# Vivado block design design_1, xczu28dr-ffvg1517-2-e, Vivado 2021.1
# (continued, part 5 of 9)
current_bd_instance /mapping_ADC_to_chan

# ---- hierarchy /mapping_chan_to_DAC ----
current_bd_instance /mapping_chan_to_DAC
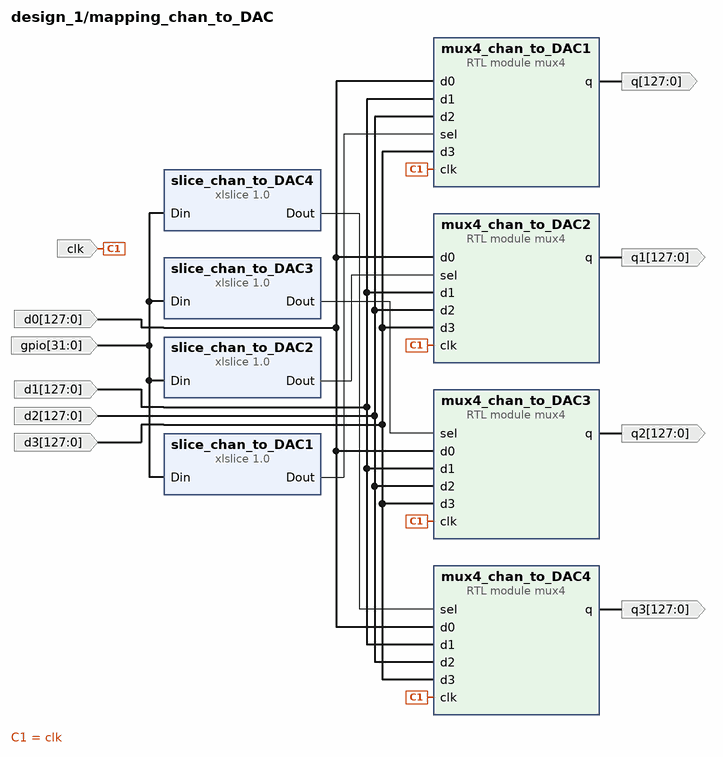
[diagram p43: block diagram inside /mapping_chan_to_DAC]
create_bd_pin -dir I -from 127 -to 0 d0
create_bd_pin -dir I -from 127 -to 0 d1
create_bd_pin -dir I -from 127 -to 0 d2
create_bd_pin -dir I -from 127 -to 0 d3
create_bd_pin -dir I -type clk clk
create_bd_pin -dir O -from 127 -to 0 q
create_bd_pin -dir I -from 31 -to 0 gpio
create_bd_pin -dir O -from 127 -to 0 q1
create_bd_pin -dir O -from 127 -to 0 q2
create_bd_pin -dir O -from 127 -to 0 q3

create_bd_cell -type ip -vlnv xilinx.com:ip:xlslice:1.0 slice_chan_to_DAC1
set_property -dict {CONFIG.DIN_FROM 1 CONFIG.DIN_TO 0 CONFIG.DOUT_WIDTH 2} [get_bd_cells slice_chan_to_DAC1]
create_bd_cell -type ip -vlnv xilinx.com:ip:xlslice:1.0 slice_chan_to_DAC2
set_property -dict {CONFIG.DIN_FROM 3 CONFIG.DIN_TO 2 CONFIG.DOUT_WIDTH 2} [get_bd_cells slice_chan_to_DAC2]
create_bd_cell -type ip -vlnv xilinx.com:ip:xlslice:1.0 slice_chan_to_DAC3
set_property -dict {CONFIG.DIN_FROM 5 CONFIG.DIN_TO 4 CONFIG.DOUT_WIDTH 2} [get_bd_cells slice_chan_to_DAC3]
create_bd_cell -type ip -vlnv xilinx.com:ip:xlslice:1.0 slice_chan_to_DAC4
set_property -dict {CONFIG.DIN_FROM 7 CONFIG.DIN_TO 6 CONFIG.DOUT_WIDTH 2} [get_bd_cells slice_chan_to_DAC4]
create_bd_cell -type module -reference mux4 mux4_chan_to_DAC2
set_property -dict {CONFIG.width 128} [get_bd_cells mux4_chan_to_DAC2]
create_bd_cell -type module -reference mux4 mux4_chan_to_DAC3
set_property -dict {CONFIG.width 128} [get_bd_cells mux4_chan_to_DAC3]
create_bd_cell -type module -reference mux4 mux4_chan_to_DAC4
set_property -dict {CONFIG.width 128} [get_bd_cells mux4_chan_to_DAC4]
create_bd_cell -type module -reference mux4 mux4_chan_to_DAC1
set_property -dict {CONFIG.width 128} [get_bd_cells mux4_chan_to_DAC1]

# ---- connections ----

current_bd_instance /ethWrapPort0
connect_bd_intf_net [get_bd_intf_pins S00_AXI] [get_bd_intf_pins eth_regs_0/S00_AXI]
connect_bd_net [get_bd_pins clk_125] \
  [get_bd_pins blk_mem_gen_0/clkb] [get_bd_pins c_shift_ram_0/CLK] [get_bd_pins c_accum_0/CLK] \
  [get_bd_pins eth_buffer_0/clk_eth]
connect_bd_net [get_bd_pins blk_mem_gen_0/doutb] [get_bd_pins eth_buffer_0/r_data]
connect_bd_net [get_bd_pins c_accum_0/Q] [get_bd_pins Q_packet_count]
connect_bd_net [get_bd_pins c_shift_ram_0/Q] [get_bd_pins Q_data_byte]
connect_bd_net -net chan1_accum_snap_sync [get_bd_pins start] [get_bd_pins eth_buffer_0/start]
connect_bd_net -net clk_wiz_0_clk_out1 [get_bd_pins clk_256] [get_bd_pins blk_mem_gen_0/clka] [get_bd_pins eth_buffer_0/clk_fab]
connect_bd_net [get_bd_pins dina] [get_bd_pins blk_mem_gen_0/dina]
connect_bd_net [get_bd_pins eth_buffer_0/data_byte] [get_bd_pins c_shift_ram_0/D]
connect_bd_net [get_bd_pins eth_buffer_0/eth_start_trig] [get_bd_pins c_accum_0/B] [get_bd_pins eth_start_trig]
connect_bd_net [get_bd_pins eth_buffer_0/r_data_addr] [get_bd_pins blk_mem_gen_0/addrb]
connect_bd_net [get_bd_pins eth_buffer_0/r_data_en] [get_bd_pins blk_mem_gen_0/enb]
connect_bd_net [get_bd_pins eth_buffer_0/w_data_addr] [get_bd_pins blk_mem_gen_0/addra]
connect_bd_net [get_bd_pins eth_buffer_0/w_data_en] [get_bd_pins blk_mem_gen_0/ena] [get_bd_pins blk_mem_gen_0/wea]
connect_bd_net [get_bd_pins eth_regs_0/dst_ip] [get_bd_pins dst_ip]
connect_bd_net [get_bd_pins eth_regs_0/dst_mac] [get_bd_pins dst_mac]
connect_bd_net [get_bd_pins eth_regs_0/src_ip] [get_bd_pins src_ip]
connect_bd_net [get_bd_pins eth_regs_0/src_mac] [get_bd_pins src_mac]
connect_bd_net [get_bd_pins r_max_count/dout] [get_bd_pins eth_buffer_0/r_max_count]
connect_bd_net -net rst_ps8_0_99M1_peripheral_aresetn [get_bd_pins s_axi_aresetn99] [get_bd_pins eth_regs_0/s00_axi_aresetn]
connect_bd_net -net s00_axi_aclk_1 [get_bd_pins s_axi_aclk99] [get_bd_pins eth_regs_0/s00_axi_aclk]
connect_bd_net -net xlconstant_1_dout [get_bd_pins w_max_count/dout] [get_bd_pins eth_buffer_0/w_max_count]

current_bd_instance /chan1
connect_bd_intf_net [get_bd_intf_pins S_AXI_bram_ctrl_0] [get_bd_intf_pins snap_data_capture/S_AXI_bram_ctrl_0]
connect_bd_intf_net [get_bd_intf_pins S_AXI_bram_ctrl_1] [get_bd_intf_pins snap_data_capture/S_AXI_bram_ctrl_1]
connect_bd_intf_net [get_bd_intf_pins S_AXI_gpio_0] [get_bd_intf_pins GPIO/S_AXI_gpio_0]
connect_bd_intf_net [get_bd_intf_pins S_AXI_gpio_1] [get_bd_intf_pins GPIO/S_AXI_gpio_1]
connect_bd_intf_net [get_bd_intf_pins S_AXI_gpio_2] [get_bd_intf_pins GPIO/S_AXI_gpio_2]
connect_bd_intf_net [get_bd_intf_pins S_AXI_gpio_3] [get_bd_intf_pins GPIO/S_AXI_gpio_3]
connect_bd_intf_net [get_bd_intf_pins S_AXI_gpio_4] [get_bd_intf_pins GPIO/S_AXI_gpio_4]
connect_bd_intf_net [get_bd_intf_pins S_AXI_gpio_5] [get_bd_intf_pins GPIO/S_AXI_gpio_5]
connect_bd_intf_net [get_bd_intf_pins S_AXI_gpio_6] [get_bd_intf_pins GPIO/S_AXI_gpio_6]
connect_bd_intf_net [get_bd_intf_pins S_AXI_gpio_7] [get_bd_intf_pins GPIO/S_AXI_gpio_7]
connect_bd_intf_net [get_bd_intf_pins S_AXI_gpio_8] [get_bd_intf_pins GPIO/S_AXI_gpio_8]
connect_bd_intf_net [get_bd_intf_pins S_AXI_gpio_9] [get_bd_intf_pins GPIO/S_AXI_gpio_9]
connect_bd_intf_net [get_bd_intf_pins S_AXI_gpio_10] [get_bd_intf_pins GPIO/S_AXI_gpio_10]
connect_bd_net [get_bd_pins ADC_data_im] [get_bd_pins fine_nco/ADC_data_im] [get_bd_pins snap_data_capture/ADC_data_im]
connect_bd_net [get_bd_pins ADC_data_re] [get_bd_pins fine_nco/ADC_data_re] [get_bd_pins snap_data_capture/ADC_data_re]
connect_bd_net -net clk_wiz_0_clk_out1 [get_bd_pins CLK] \
  [get_bd_pins c_shift_ram_4/CLK] [get_bd_pins psb3_0_0/clk] [get_bd_pins psb_out_post/clk] [get_bd_pins fine_nco/clk_256M] \
  [get_bd_pins snap_data_capture/clk_256M] [get_bd_pins receive1_3_0/clk]
connect_bd_net [get_bd_pins const_zero31/dout] [get_bd_pins xlconcat_6/In3]
connect_bd_net -net cordic_mix_v2_ADC_out_im_0 [get_bd_pins fine_nco/out_im_0] [get_bd_pins receive1_3_0/in_re_0]
connect_bd_net -net cordic_mix_v2_ADC_out_im_1 [get_bd_pins fine_nco/out_im_1] [get_bd_pins receive1_3_0/in_re_1]
connect_bd_net -net cordic_mix_v2_ADC_out_im_2 [get_bd_pins fine_nco/out_im_2] [get_bd_pins receive1_3_0/in_re_2]
connect_bd_net -net cordic_mix_v2_ADC_out_im_3 [get_bd_pins fine_nco/out_im_3] [get_bd_pins receive1_3_0/in_re_3]
connect_bd_net -net cordic_mix_v2_ADC_out_re_0 [get_bd_pins fine_nco/out_re_0] [get_bd_pins receive1_3_0/in_im_0]
connect_bd_net -net cordic_mix_v2_ADC_out_re_1 [get_bd_pins fine_nco/out_re_1] [get_bd_pins receive1_3_0/in_im_1]
connect_bd_net -net cordic_mix_v2_ADC_out_re_2 [get_bd_pins fine_nco/out_re_2] [get_bd_pins receive1_3_0/in_im_2]
connect_bd_net -net cordic_mix_v2_ADC_out_re_3 [get_bd_pins fine_nco/out_re_3] [get_bd_pins receive1_3_0/in_im_3]
connect_bd_net -net proc_sys_reset_0_peripheral_aresetn [get_bd_pins s_axi_aresetn256] [get_bd_pins snap_data_capture/s_axi_aresetn256]
connect_bd_net -net psb2_0_0_gout_psb_tvalid [get_bd_pins c_shift_ram_4/Q] [get_bd_pins receive1_3_0/in_tvalid]
connect_bd_net [get_bd_pins psb3_0_0/gout_ov_add] [get_bd_pins xlconcat_6/In2]
connect_bd_net [get_bd_pins psb3_0_0/gout_ov_ifft] [get_bd_pins xlconcat_6/In1]
connect_bd_net [get_bd_pins psb3_0_0/gout_psb_tvalid] [get_bd_pins c_shift_ram_4/D]
connect_bd_net -net psb_im0_1 [get_bd_pins psb3_0_0/gout_psb_im_0] [get_bd_pins psb_out_post/psb_im0]
connect_bd_net -net psb_im1_1 [get_bd_pins psb3_0_0/gout_psb_im_1] [get_bd_pins psb_out_post/psb_im1]
connect_bd_net -net psb_im2_1 [get_bd_pins psb3_0_0/gout_psb_im_2] [get_bd_pins psb_out_post/psb_im2]
connect_bd_net -net psb_im3_1 [get_bd_pins psb3_0_0/gout_psb_im_3] [get_bd_pins psb_out_post/psb_im3]
connect_bd_net -net psb_re0_1 [get_bd_pins psb3_0_0/gout_psb_re_0] [get_bd_pins psb_out_post/psb_re0]
connect_bd_net -net psb_re1_1 [get_bd_pins psb3_0_0/gout_psb_re_1] [get_bd_pins psb_out_post/psb_re1]
connect_bd_net -net psb_re2_1 [get_bd_pins psb3_0_0/gout_psb_re_2] [get_bd_pins psb_out_post/psb_re2]
connect_bd_net -net psb_re3_1 [get_bd_pins psb3_0_0/gout_psb_re_3] [get_bd_pins psb_out_post/psb_re3]
connect_bd_net [get_bd_pins receive1_3_0/acc_tvalid] [get_bd_pins snap_data_capture/tvalid]
connect_bd_net [get_bd_pins receive1_3_0/acc_tvalid_eth] [get_bd_pins acc_tvalid_eth]
connect_bd_net [get_bd_pins receive1_3_0/snap_i0] [get_bd_pins xlconcat_1/In0]
connect_bd_net [get_bd_pins receive1_3_0/snap_i1] [get_bd_pins xlconcat_1/In2]
connect_bd_net [get_bd_pins receive1_3_0/snap_i2] [get_bd_pins xlconcat_1/In4]
connect_bd_net [get_bd_pins receive1_3_0/snap_i3] [get_bd_pins xlconcat_1/In6]
connect_bd_net [get_bd_pins receive1_3_0/snap_q0] [get_bd_pins xlconcat_1/In1]
connect_bd_net [get_bd_pins receive1_3_0/snap_q1] [get_bd_pins xlconcat_1/In3]
connect_bd_net [get_bd_pins receive1_3_0/snap_q2] [get_bd_pins xlconcat_1/In5]
connect_bd_net [get_bd_pins receive1_3_0/snap_q3] [get_bd_pins xlconcat_1/In7]
connect_bd_net -net reset_Dout [get_bd_pins GPIO/psb_rst] [get_bd_pins psb3_0_0/gin_tl_reset]
connect_bd_net -net rst_ps8_0_99M_peripheral_aresetn [get_bd_pins s_axi_aresetn99] [get_bd_pins GPIO/s_axi_aresetn]
connect_bd_net -net scale_const16_1 [get_bd_pins GPIO/psb_postScale] [get_bd_pins psb_out_post/scale_const16]
connect_bd_net -net scaler_16bits_1_ov [get_bd_pins psb_out_post/ov] [get_bd_pins xlconcat_6/In0]
connect_bd_net -net scaler_16bits_1_psb_dac_im0 [get_bd_pins psb_out_post/psb_dac_im0] [get_bd_pins fine_nco/DAC_im_0]
connect_bd_net -net scaler_16bits_1_psb_dac_im1 [get_bd_pins psb_out_post/psb_dac_im1] [get_bd_pins fine_nco/DAC_im_1]
connect_bd_net -net scaler_16bits_1_psb_dac_im2 [get_bd_pins psb_out_post/psb_dac_im2] [get_bd_pins fine_nco/DAC_im_2]
connect_bd_net -net scaler_16bits_1_psb_dac_im3 [get_bd_pins psb_out_post/psb_dac_im3] [get_bd_pins fine_nco/DAC_im_3]
connect_bd_net -net scaler_16bits_1_psb_dac_re0 [get_bd_pins psb_out_post/psb_dac_re0] [get_bd_pins fine_nco/DAC_re_0]
connect_bd_net -net scaler_16bits_1_psb_dac_re1 [get_bd_pins psb_out_post/psb_dac_re1] [get_bd_pins fine_nco/DAC_re_1]
connect_bd_net -net scaler_16bits_1_psb_dac_re2 [get_bd_pins psb_out_post/psb_dac_re2] [get_bd_pins fine_nco/DAC_re_2]
connect_bd_net -net scaler_16bits_1_psb_dac_re3 [get_bd_pins psb_out_post/psb_dac_re3] [get_bd_pins fine_nco/DAC_re_3]
connect_bd_net -net start_Dout [get_bd_pins GPIO/psb_start] [get_bd_pins psb3_0_0/gin_tl_start] [get_bd_pins start_chan1]
connect_bd_net -net we_even_1_Dout [get_bd_pins GPIO/psb_tone_we_even1] [get_bd_pins psb3_0_0/gin_we_even_1]
connect_bd_net -net we_even_2_Dout [get_bd_pins GPIO/psb_tone_we_even2] [get_bd_pins psb3_0_0/gin_we_even_2]
connect_bd_net -net we_even_3_Dout [get_bd_pins GPIO/psb_tone_we_even3] [get_bd_pins psb3_0_0/gin_we_even_3]
connect_bd_net -net we_even_4_Dout [get_bd_pins GPIO/psb_tone_we_even4] [get_bd_pins psb3_0_0/gin_we_even_4]
connect_bd_net -net we_odd_10_Dout [get_bd_pins GPIO/psb_toneSelect_w_D3] [get_bd_pins psb3_0_0/ts_3]
connect_bd_net -net we_odd_11_Dout [get_bd_pins GPIO/psb_toneSelect_w_D4] [get_bd_pins psb3_0_0/ts_4]
connect_bd_net -net we_odd_12_Dout [get_bd_pins GPIO/psb_toneSelect_w_D5] [get_bd_pins psb3_0_0/ts_5]
connect_bd_net -net we_odd_13_Dout [get_bd_pins GPIO/psb_toneSelect_w_D6] [get_bd_pins psb3_0_0/ts_6]
connect_bd_net -net we_odd_14_Dout [get_bd_pins GPIO/psb_toneSelect_w_D7] [get_bd_pins psb3_0_0/ts_7]
connect_bd_net -net we_odd_1_Dout [get_bd_pins GPIO/psb_tone_we_odd1] [get_bd_pins psb3_0_0/gin_we_odd_1]
connect_bd_net -net we_odd_2_Dout [get_bd_pins GPIO/psb_tone_we_odd2] [get_bd_pins psb3_0_0/gin_we_odd_2]
connect_bd_net -net we_odd_3_Dout [get_bd_pins GPIO/psb_tone_we_odd3] [get_bd_pins psb3_0_0/gin_we_odd_3]
connect_bd_net -net we_odd_4_Dout [get_bd_pins GPIO/psb_tone_we_odd4] [get_bd_pins psb3_0_0/gin_we_odd_4]
connect_bd_net -net we_odd_5_Dout [get_bd_pins GPIO/psb_toneSelect_we] [get_bd_pins psb3_0_0/ts_w]
connect_bd_net -net we_odd_6_Dout [get_bd_pins GPIO/psb_toneSelect_w_addr] [get_bd_pins psb3_0_0/ts_a]
connect_bd_net -net we_odd_7_Dout [get_bd_pins GPIO/psb_toneSelect_w_D0] [get_bd_pins psb3_0_0/ts_0]
connect_bd_net -net we_odd_8_Dout [get_bd_pins GPIO/psb_toneSelect_w_D1] [get_bd_pins psb3_0_0/ts_1]
connect_bd_net -net we_odd_9_Dout [get_bd_pins GPIO/psb_toneSelect_w_D2] [get_bd_pins psb3_0_0/ts_2]
connect_bd_net -net xlconcat_0_dout [get_bd_pins fine_nco/to_DAC] [get_bd_pins to_DAC] [get_bd_pins snap_data_capture/DAC_data]
connect_bd_net [get_bd_pins xlconcat_1/dout] [get_bd_pins timestream_out] [get_bd_pins snap_data_capture/rec_output]
connect_bd_net [get_bd_pins xlconcat_6/dout] [get_bd_pins GPIO/dsp_ov_flag]
connect_bd_net [get_bd_pins xlconstant_7/dout] [get_bd_pins fine_nco/sync_in]
connect_bd_net -net xlslice_0_Dout [get_bd_pins GPIO/psb_tone_w_init_re] [get_bd_pins psb3_0_0/gin_init_re]
connect_bd_net -net xlslice_1_Dout [get_bd_pins GPIO/psb_tone_w_init_im] [get_bd_pins psb3_0_0/gin_init_im]
connect_bd_net -net xlslice_3_Dout [get_bd_pins GPIO/psb_tone_w_addr] [get_bd_pins psb3_0_0/gin_addr]
connect_bd_net -net xlslice_4_Dout [get_bd_pins GPIO/psb_tone_w_dphi] [get_bd_pins psb3_0_0/gin_dphi]
connect_bd_net -net xlslice_5_Dout [get_bd_pins GPIO/rec_acc_length] [get_bd_pins receive1_3_0/acc_length]
connect_bd_net -net xlslice_beat_addr_Dout [get_bd_pins GPIO/rec_beatDphi_w_addr] [get_bd_pins receive1_3_0/w_beat_addr]
connect_bd_net -net xlslice_beat_dphi_Dout [get_bd_pins GPIO/rec_beatDphi_w_D] [get_bd_pins receive1_3_0/w_beat_dphi]
connect_bd_net -net xlslice_beat_we0_Dout [get_bd_pins GPIO/rec_beatDphi_we0] [get_bd_pins receive1_3_0/beat_we0]
connect_bd_net -net xlslice_beat_we1_Dout [get_bd_pins GPIO/rec_beatDphi_we1] [get_bd_pins receive1_3_0/beat_we1]
connect_bd_net -net xlslice_beat_we2_Dout [get_bd_pins GPIO/rec_beatDphi_we2] [get_bd_pins receive1_3_0/beat_we2]
connect_bd_net -net xlslice_beat_we3_Dout [get_bd_pins GPIO/rec_beatDphi_we3] [get_bd_pins receive1_3_0/beat_we3]
connect_bd_net -net xlslice_bin_sel_addr_Dout [get_bd_pins GPIO/rec_binSelect_w_addr] [get_bd_pins receive1_3_0/w_binsel_addr]
connect_bd_net -net xlslice_bin_sel_data1_Dout [get_bd_pins GPIO/rec_binSelect_w_D1] [get_bd_pins receive1_3_0/w_binsel_data1]
connect_bd_net -net xlslice_bin_sel_data_Dout [get_bd_pins GPIO/rec_binSelect_w_D0] [get_bd_pins receive1_3_0/w_binsel_data0]
connect_bd_net -net xlslice_bin_sel_we_Dout [get_bd_pins GPIO/rec_binSelect_we] [get_bd_pins receive1_3_0/binsel_we]
connect_bd_net -net xlslice_bram_rst_Dout [get_bd_pins GPIO/getAccumCtrl_rst] [get_bd_pins snap_data_capture/getAccumCtrl_rst]
connect_bd_net -net xlslice_bramx32v2_start_Dout [get_bd_pins GPIO/axibramx32v2_start] [get_bd_pins snap_data_capture/axibramx32v2_start]
connect_bd_net -net xlslice_dacmix_dp_Dout [get_bd_pins GPIO/fineNCO_dphi] [get_bd_pins fine_nco/dphi]
connect_bd_net -net xlslice_fft_scale_Dout [get_bd_pins GPIO/rec_fft_scale] [get_bd_pins receive1_3_0/fft_scale]
connect_bd_net -net xlslice_getAccumChan_Dout [get_bd_pins GPIO/getAccum_channel_count] [get_bd_pins snap_data_capture/max_chan_minus_three]
connect_bd_net -net zynq_ultra_ps_e_0_pl_clk0 [get_bd_pins s_axi_aclk99] [get_bd_pins GPIO/s_axi_aclk]

current_bd_instance /chan1/snap_data_capture
connect_bd_intf_net [get_bd_intf_pins axi_bram_ctrl_0/BRAM_PORTA] [get_bd_intf_pins blk_mem_gen_0/BRAM_PORTA]
connect_bd_intf_net [get_bd_intf_pins axi_bram_ctrl_1/BRAM_PORTA] [get_bd_intf_pins blk_mem_gen_1/BRAM_PORTA]
connect_bd_intf_net [get_bd_intf_pins S_AXI_bram_ctrl_0] [get_bd_intf_pins axi_bram_ctrl_0/S_AXI]
connect_bd_intf_net [get_bd_intf_pins S_AXI_bram_ctrl_1] [get_bd_intf_pins axi_bram_ctrl_1/S_AXI]
connect_bd_net [get_bd_pins ADC_data_im] [get_bd_pins c_shift_ram_3/D]
connect_bd_net [get_bd_pins ADC_data_re] [get_bd_pins c_shift_ram_2/D]
connect_bd_net -net axibramx32v1_0_we [get_bd_pins axibramx32v2_0/we] \
  [get_bd_pins xlconcat_3/In0] [get_bd_pins xlconcat_3/In1] [get_bd_pins xlconcat_3/In2] [get_bd_pins xlconcat_3/In3] \
  [get_bd_pins xlconcat_3/In4] [get_bd_pins xlconcat_3/In5] [get_bd_pins xlconcat_3/In6] [get_bd_pins xlconcat_3/In7] \
  [get_bd_pins xlconcat_3/In8] [get_bd_pins xlconcat_3/In9] [get_bd_pins xlconcat_3/In10] [get_bd_pins xlconcat_3/In11] \
  [get_bd_pins xlconcat_3/In13] [get_bd_pins xlconcat_3/In12] [get_bd_pins xlconcat_3/In14] [get_bd_pins xlconcat_3/In15] \
  [get_bd_pins xlconcat_3/In16] [get_bd_pins xlconcat_3/In17] [get_bd_pins xlconcat_3/In18] [get_bd_pins xlconcat_3/In19] \
  [get_bd_pins xlconcat_3/In20] [get_bd_pins xlconcat_3/In21] [get_bd_pins xlconcat_3/In22] [get_bd_pins xlconcat_3/In23] \
  [get_bd_pins xlconcat_3/In24] [get_bd_pins xlconcat_3/In25] [get_bd_pins xlconcat_3/In26] [get_bd_pins xlconcat_3/In27] \
  [get_bd_pins xlconcat_3/In28] [get_bd_pins xlconcat_3/In29] [get_bd_pins xlconcat_3/In30] [get_bd_pins xlconcat_3/In31]
connect_bd_net -net axibramx32v1_0_we1 [get_bd_pins getAccumCtrl_0/we] \
  [get_bd_pins xlconcat_4/In0] [get_bd_pins xlconcat_4/In1] [get_bd_pins xlconcat_4/In2] [get_bd_pins xlconcat_4/In3] \
  [get_bd_pins xlconcat_4/In4] [get_bd_pins xlconcat_4/In5] [get_bd_pins xlconcat_4/In6] [get_bd_pins xlconcat_4/In7] \
  [get_bd_pins xlconcat_4/In8] [get_bd_pins xlconcat_4/In9] [get_bd_pins xlconcat_4/In10] [get_bd_pins xlconcat_4/In11] \
  [get_bd_pins xlconcat_4/In12] [get_bd_pins xlconcat_4/In13] [get_bd_pins xlconcat_4/In14] [get_bd_pins xlconcat_4/In15] \
  [get_bd_pins xlconcat_4/In16] [get_bd_pins xlconcat_4/In17] [get_bd_pins xlconcat_4/In18] [get_bd_pins xlconcat_4/In19] \
  [get_bd_pins xlconcat_4/In20] [get_bd_pins xlconcat_4/In21] [get_bd_pins xlconcat_4/In22] [get_bd_pins xlconcat_4/In23] \
  [get_bd_pins xlconcat_4/In24] [get_bd_pins xlconcat_4/In25] [get_bd_pins xlconcat_4/In26] [get_bd_pins xlconcat_4/In27] \
  [get_bd_pins xlconcat_4/In28] [get_bd_pins xlconcat_4/In29] [get_bd_pins xlconcat_4/In30] [get_bd_pins xlconcat_4/In31]
connect_bd_net [get_bd_pins axibramx32v2_0/addr] [get_bd_pins blk_mem_gen_0/addrb]
connect_bd_net [get_bd_pins bool_one/dout] [get_bd_pins blk_mem_gen_0/enb] [get_bd_pins blk_mem_gen_1/enb]
connect_bd_net [get_bd_pins bool_zero/dout] [get_bd_pins blk_mem_gen_0/rstb] [get_bd_pins blk_mem_gen_1/rstb]
connect_bd_net [get_bd_pins c_shift_ram_0/Q] [get_bd_pins blk_mem_gen_1/dinb]
connect_bd_net [get_bd_pins c_shift_ram_1/Q] [get_bd_pins xlconcat_DataConv/In0]
connect_bd_net [get_bd_pins c_shift_ram_2/Q] [get_bd_pins xlconcat_DataConv/In1]
connect_bd_net [get_bd_pins c_shift_ram_3/Q] [get_bd_pins xlconcat_DataConv/In2]
connect_bd_net -net clk_wiz_0_clk_out1 [get_bd_pins clk_256M] \
  [get_bd_pins blk_mem_gen_0/clkb] [get_bd_pins axi_bram_ctrl_0/s_axi_aclk] [get_bd_pins blk_mem_gen_1/clkb] \
  [get_bd_pins axi_bram_ctrl_1/s_axi_aclk] [get_bd_pins getAccumCtrl_0/clk] [get_bd_pins axibramx32v2_0/clk] \
  [get_bd_pins c_shift_ram_0/CLK] [get_bd_pins c_shift_ram_3/CLK] [get_bd_pins c_shift_ram_1/CLK] \
  [get_bd_pins c_shift_ram_2/CLK]
connect_bd_net -net const_2097088_dout [get_bd_pins const_65472/dout] \
  [get_bd_pins axibramx32v2_0/max_count_minus_two_steps] [get_bd_pins getAccumCtrl_0/max_count_minus_two_step]
connect_bd_net [get_bd_pins getAccumCtrl_0/addr] [get_bd_pins blk_mem_gen_1/addrb]
connect_bd_net -net proc_sys_reset_0_peripheral_aresetn [get_bd_pins s_axi_aresetn256] \
  [get_bd_pins axi_bram_ctrl_1/s_axi_aresetn] [get_bd_pins axi_bram_ctrl_0/s_axi_aresetn]
connect_bd_net -net receive1_3_0_acc_tvalid [get_bd_pins tvalid] [get_bd_pins getAccumCtrl_0/tvalid]
connect_bd_net -net xlconcat_0_dout [get_bd_pins DAC_data] [get_bd_pins c_shift_ram_1/D]
connect_bd_net -net xlconcat_1_dout [get_bd_pins rec_output] [get_bd_pins c_shift_ram_0/D]
connect_bd_net [get_bd_pins xlconcat_3/dout] [get_bd_pins blk_mem_gen_0/web]
connect_bd_net [get_bd_pins xlconcat_4/dout] [get_bd_pins blk_mem_gen_1/web]
connect_bd_net -net xlconcat_ADCout_dout [get_bd_pins xlconcat_DataConv/dout] [get_bd_pins blk_mem_gen_0/dinb]
connect_bd_net -net xlslice_bram_rst_Dout [get_bd_pins getAccumCtrl_rst] [get_bd_pins getAccumCtrl_0/rst]
connect_bd_net -net xlslice_bramx32v2_start_Dout [get_bd_pins axibramx32v2_start] [get_bd_pins axibramx32v2_0/rising_edge_start]
connect_bd_net -net xlslice_getAccumChan_Dout [get_bd_pins max_chan_minus_three] [get_bd_pins getAccumCtrl_0/max_chan_minus_three]

current_bd_instance /chan1/GPIO
connect_bd_intf_net [get_bd_intf_pins S_AXI_gpio_5] [get_bd_intf_pins axi_gpio_5/S_AXI]
connect_bd_intf_net [get_bd_intf_pins S_AXI_gpio_0] [get_bd_intf_pins axi_gpio_0/S_AXI]
connect_bd_intf_net [get_bd_intf_pins S_AXI_gpio_1] [get_bd_intf_pins axi_gpio_1/S_AXI]
connect_bd_intf_net [get_bd_intf_pins S_AXI_gpio_2] [get_bd_intf_pins axi_gpio_2/S_AXI]
connect_bd_intf_net [get_bd_intf_pins S_AXI_gpio_3] [get_bd_intf_pins axi_gpio_3/S_AXI]
connect_bd_intf_net [get_bd_intf_pins S_AXI_gpio_4] [get_bd_intf_pins axi_gpio_4/S_AXI]
connect_bd_intf_net [get_bd_intf_pins S_AXI_gpio_6] [get_bd_intf_pins axi_gpio_6/S_AXI]
connect_bd_intf_net [get_bd_intf_pins S_AXI_gpio_7] [get_bd_intf_pins axi_gpio_7/S_AXI]
connect_bd_intf_net [get_bd_intf_pins S_AXI_gpio_8] [get_bd_intf_pins axi_gpio_8/S_AXI]
connect_bd_intf_net [get_bd_intf_pins S_AXI_gpio_9] [get_bd_intf_pins axi_gpio_9/S_AXI]
connect_bd_intf_net [get_bd_intf_pins S_AXI_gpio_10] [get_bd_intf_pins axi_gpio_10/S_AXI]
connect_bd_net [get_bd_pins axi_gpio_4/gpio_io_o] \
  [get_bd_pins xlslice_beat_we0/Din] [get_bd_pins xlslice_beat_we1/Din] [get_bd_pins xlslice_beat_we2/Din] \
  [get_bd_pins xlslice_beat_we3/Din] [get_bd_pins xlslice_beat_dphi/Din] [get_bd_pins xlslice_beat_addr/Din]
connect_bd_net [get_bd_pins axi_gpio_9/gpio_io_o] [get_bd_pins xlslice_bin_sel_addr/Din] [get_bd_pins xlslice_bin_sel_data0/Din]
connect_bd_net [get_bd_pins axi_gpio_0/gpio_io_o] [get_bd_pins start/Din] [get_bd_pins reset/Din]
connect_bd_net [get_bd_pins axi_gpio_10/gpio_io_o] [get_bd_pins xlslice_mix_dp/Din]
connect_bd_net [get_bd_pins axi_gpio_1/gpio2_io_o] [get_bd_pins xlslice_3/Din] [get_bd_pins xlslice_4/Din]
connect_bd_net [get_bd_pins axi_gpio_1/gpio_io_o] \
  [get_bd_pins we_even_1/Din] [get_bd_pins we_even_2/Din] [get_bd_pins we_even_3/Din] [get_bd_pins we_even_4/Din] \
  [get_bd_pins we_odd_1/Din] [get_bd_pins we_odd_2/Din] [get_bd_pins we_odd_3/Din] [get_bd_pins we_odd_4/Din]
connect_bd_net [get_bd_pins axi_gpio_2/gpio2_io_o] [get_bd_pins xlslice_1/Din]
connect_bd_net [get_bd_pins axi_gpio_2/gpio_io_o] [get_bd_pins xlslice_0/Din]
connect_bd_net [get_bd_pins axi_gpio_3/gpio2_io_o] [get_bd_pins xlslice_bramx32v2_start/Din] [get_bd_pins xlslice_getAccum_rst/Din]
connect_bd_net [get_bd_pins axi_gpio_3/gpio_io_o] [get_bd_pins xlslice_acc_length/Din] [get_bd_pins xlslice_getAccumChan/Din]
connect_bd_net [get_bd_pins axi_gpio_4/gpio2_io_o] [get_bd_pins xlslice_fft_scale/Din]
connect_bd_net [get_bd_pins axi_gpio_5/gpio_io_o] [get_bd_pins xlslice_PSBscaleC/Din]
connect_bd_net [get_bd_pins axi_gpio_6/gpio2_io_o] [get_bd_pins we_odd_6/Din]
connect_bd_net [get_bd_pins axi_gpio_6/gpio_io_o] [get_bd_pins we_odd_5/Din]
connect_bd_net [get_bd_pins axi_gpio_7/gpio2_io_o] [get_bd_pins we_odd_9/Din] [get_bd_pins we_odd_10/Din]
connect_bd_net [get_bd_pins axi_gpio_7/gpio_io_o] [get_bd_pins we_odd_7/Din] [get_bd_pins we_odd_8/Din]
connect_bd_net [get_bd_pins axi_gpio_8/gpio2_io_o] [get_bd_pins we_odd_13/Din] [get_bd_pins we_odd_14/Din]
connect_bd_net [get_bd_pins axi_gpio_8/gpio_io_o] [get_bd_pins we_odd_11/Din] [get_bd_pins we_odd_12/Din]
connect_bd_net [get_bd_pins axi_gpio_9/gpio2_io_o] [get_bd_pins xlslice_bin_sel_data1/Din] [get_bd_pins xlslice_bin_sel_we/Din]
connect_bd_net -net gpio2_io_i_1 [get_bd_pins dsp_ov_flag] [get_bd_pins axi_gpio_5/gpio2_io_i]
connect_bd_net [get_bd_pins reset/Dout] [get_bd_pins psb_rst]
connect_bd_net -net rst_ps8_0_99M_peripheral_aresetn [get_bd_pins s_axi_aresetn] \
  [get_bd_pins axi_gpio_0/s_axi_aresetn] [get_bd_pins axi_gpio_1/s_axi_aresetn] [get_bd_pins axi_gpio_2/s_axi_aresetn] \
  [get_bd_pins axi_gpio_3/s_axi_aresetn] [get_bd_pins axi_gpio_4/s_axi_aresetn] [get_bd_pins axi_gpio_7/s_axi_aresetn] \
  [get_bd_pins axi_gpio_8/s_axi_aresetn] [get_bd_pins axi_gpio_9/s_axi_aresetn] [get_bd_pins axi_gpio_10/s_axi_aresetn] \
  [get_bd_pins axi_gpio_6/s_axi_aresetn] [get_bd_pins axi_gpio_5/s_axi_aresetn]
connect_bd_net [get_bd_pins start/Dout] [get_bd_pins psb_start]
connect_bd_net [get_bd_pins we_even_1/Dout] [get_bd_pins psb_tone_we_even1]
connect_bd_net [get_bd_pins we_even_2/Dout] [get_bd_pins psb_tone_we_even2]
connect_bd_net [get_bd_pins we_even_3/Dout] [get_bd_pins psb_tone_we_even3]
connect_bd_net [get_bd_pins we_even_4/Dout] [get_bd_pins psb_tone_we_even4]
connect_bd_net [get_bd_pins we_odd_10/Dout] [get_bd_pins psb_toneSelect_w_D3]
connect_bd_net [get_bd_pins we_odd_11/Dout] [get_bd_pins psb_toneSelect_w_D4]
connect_bd_net [get_bd_pins we_odd_12/Dout] [get_bd_pins psb_toneSelect_w_D5]
connect_bd_net [get_bd_pins we_odd_13/Dout] [get_bd_pins psb_toneSelect_w_D6]
connect_bd_net [get_bd_pins we_odd_14/Dout] [get_bd_pins psb_toneSelect_w_D7]
connect_bd_net [get_bd_pins we_odd_1/Dout] [get_bd_pins psb_tone_we_odd1]
connect_bd_net [get_bd_pins we_odd_2/Dout] [get_bd_pins psb_tone_we_odd2]
connect_bd_net [get_bd_pins we_odd_3/Dout] [get_bd_pins psb_tone_we_odd3]
connect_bd_net [get_bd_pins we_odd_4/Dout] [get_bd_pins psb_tone_we_odd4]
connect_bd_net [get_bd_pins we_odd_5/Dout] [get_bd_pins psb_toneSelect_we]
connect_bd_net [get_bd_pins we_odd_6/Dout] [get_bd_pins psb_toneSelect_w_addr]
connect_bd_net [get_bd_pins we_odd_7/Dout] [get_bd_pins psb_toneSelect_w_D0]
connect_bd_net [get_bd_pins we_odd_8/Dout] [get_bd_pins psb_toneSelect_w_D1]
connect_bd_net [get_bd_pins we_odd_9/Dout] [get_bd_pins psb_toneSelect_w_D2]
connect_bd_net [get_bd_pins xlslice_0/Dout] [get_bd_pins psb_tone_w_init_re]
connect_bd_net [get_bd_pins xlslice_1/Dout] [get_bd_pins psb_tone_w_init_im]
connect_bd_net [get_bd_pins xlslice_3/Dout] [get_bd_pins psb_tone_w_addr]
connect_bd_net [get_bd_pins xlslice_4/Dout] [get_bd_pins psb_tone_w_dphi]
connect_bd_net -net xlslice_5_Dout [get_bd_pins xlslice_acc_length/Dout] [get_bd_pins rec_acc_length]
connect_bd_net [get_bd_pins xlslice_PSBscaleC/Dout] [get_bd_pins psb_postScale]
connect_bd_net [get_bd_pins xlslice_beat_addr/Dout] [get_bd_pins rec_beatDphi_w_addr]
connect_bd_net [get_bd_pins xlslice_beat_dphi/Dout] [get_bd_pins rec_beatDphi_w_D]
connect_bd_net [get_bd_pins xlslice_beat_we0/Dout] [get_bd_pins rec_beatDphi_we0]
connect_bd_net [get_bd_pins xlslice_beat_we1/Dout] [get_bd_pins rec_beatDphi_we1]
connect_bd_net [get_bd_pins xlslice_beat_we2/Dout] [get_bd_pins rec_beatDphi_we2]
connect_bd_net [get_bd_pins xlslice_beat_we3/Dout] [get_bd_pins rec_beatDphi_we3]
connect_bd_net [get_bd_pins xlslice_bin_sel_addr/Dout] [get_bd_pins rec_binSelect_w_addr]
connect_bd_net [get_bd_pins xlslice_bin_sel_data1/Dout] [get_bd_pins rec_binSelect_w_D1]
connect_bd_net -net xlslice_bin_sel_data_Dout [get_bd_pins xlslice_bin_sel_data0/Dout] [get_bd_pins rec_binSelect_w_D0]
connect_bd_net [get_bd_pins xlslice_bin_sel_we/Dout] [get_bd_pins rec_binSelect_we]
connect_bd_net -net xlslice_bram_rst_Dout [get_bd_pins xlslice_getAccum_rst/Dout] [get_bd_pins getAccumCtrl_rst]
connect_bd_net [get_bd_pins xlslice_bramx32v2_start/Dout] [get_bd_pins axibramx32v2_start]
connect_bd_net -net xlslice_dacmix_dp_Dout [get_bd_pins xlslice_mix_dp/Dout] [get_bd_pins fineNCO_dphi]
connect_bd_net [get_bd_pins xlslice_fft_scale/Dout] [get_bd_pins rec_fft_scale]
connect_bd_net [get_bd_pins xlslice_getAccumChan/Dout] [get_bd_pins getAccum_channel_count]
connect_bd_net -net zynq_ultra_ps_e_0_pl_clk0 [get_bd_pins s_axi_aclk] \
  [get_bd_pins axi_gpio_0/s_axi_aclk] [get_bd_pins axi_gpio_1/s_axi_aclk] [get_bd_pins axi_gpio_2/s_axi_aclk] \
  [get_bd_pins axi_gpio_3/s_axi_aclk] [get_bd_pins axi_gpio_4/s_axi_aclk] [get_bd_pins axi_gpio_7/s_axi_aclk] \
  [get_bd_pins axi_gpio_8/s_axi_aclk] [get_bd_pins axi_gpio_9/s_axi_aclk] [get_bd_pins axi_gpio_10/s_axi_aclk] \
  [get_bd_pins axi_gpio_6/s_axi_aclk] [get_bd_pins axi_gpio_5/s_axi_aclk]

current_bd_instance /chan1/psb_out_post
connect_bd_net [get_bd_pins psb_im0] [get_bd_pins xlslice_5/Din] [get_bd_pins xlslice_2/Din]
connect_bd_net [get_bd_pins psb_im1] [get_bd_pins xlslice_6/Din] [get_bd_pins xlslice_13/Din]
connect_bd_net [get_bd_pins psb_im2] [get_bd_pins xlslice_7/Din] [get_bd_pins xlslice_14/Din]
connect_bd_net [get_bd_pins psb_im3] [get_bd_pins xlslice_8/Din] [get_bd_pins xlslice_15/Din]
connect_bd_net [get_bd_pins psb_re0] [get_bd_pins xlslice_9/Din] [get_bd_pins xlslice_16/Din]
connect_bd_net [get_bd_pins psb_re1] [get_bd_pins xlslice_18/Din] [get_bd_pins xlslice_10/Din]
connect_bd_net [get_bd_pins psb_re2] [get_bd_pins xlslice_17/Din] [get_bd_pins xlslice_11/Din]
connect_bd_net [get_bd_pins psb_re3] [get_bd_pins xlslice_19/Din] [get_bd_pins xlslice_12/Din]
connect_bd_net -net clk_wiz_0_clk_out1 [get_bd_pins clk] [get_bd_pins scaler_16bits_1/clk]
connect_bd_net [get_bd_pins scaler_16bits_1/ov] [get_bd_pins ov]
connect_bd_net [get_bd_pins scaler_16bits_1/psb_dac_im0] [get_bd_pins psb_dac_im0]
connect_bd_net [get_bd_pins scaler_16bits_1/psb_dac_im1] [get_bd_pins psb_dac_im1]
connect_bd_net [get_bd_pins scaler_16bits_1/psb_dac_im2] [get_bd_pins psb_dac_im2]
connect_bd_net [get_bd_pins scaler_16bits_1/psb_dac_im3] [get_bd_pins psb_dac_im3]
connect_bd_net [get_bd_pins scaler_16bits_1/psb_dac_re0] [get_bd_pins psb_dac_re0]
connect_bd_net [get_bd_pins scaler_16bits_1/psb_dac_re1] [get_bd_pins psb_dac_re1]
connect_bd_net [get_bd_pins scaler_16bits_1/psb_dac_re2] [get_bd_pins psb_dac_re2]
connect_bd_net [get_bd_pins scaler_16bits_1/psb_dac_re3] [get_bd_pins psb_dac_re3]
connect_bd_net [get_bd_pins xlconcat_psbim0/dout] [get_bd_pins scaler_16bits_1/psb_im0]
connect_bd_net [get_bd_pins xlconcat_psbim1/dout] [get_bd_pins scaler_16bits_1/psb_im1]
connect_bd_net [get_bd_pins xlconcat_psbim2/dout] [get_bd_pins scaler_16bits_1/psb_im2]
connect_bd_net [get_bd_pins xlconcat_psbim3/dout] [get_bd_pins scaler_16bits_1/psb_im3]
connect_bd_net [get_bd_pins xlconcat_psbre0/dout] [get_bd_pins scaler_16bits_1/psb_re0]
connect_bd_net [get_bd_pins xlconcat_psbre1/dout] [get_bd_pins scaler_16bits_1/psb_re1]
connect_bd_net [get_bd_pins xlconcat_psbre2/dout] [get_bd_pins scaler_16bits_1/psb_re2]
connect_bd_net [get_bd_pins xlconcat_psbre3/dout] [get_bd_pins scaler_16bits_1/psb_re3]
connect_bd_net [get_bd_pins xlconstant_0/dout] \
  [get_bd_pins xlconcat_psbim0/In0] [get_bd_pins xlconcat_psbim1/In0] [get_bd_pins xlconcat_psbim2/In0] \
  [get_bd_pins xlconcat_psbim3/In0] [get_bd_pins xlconcat_psbre0/In0] [get_bd_pins xlconcat_psbre1/In0] \
  [get_bd_pins xlconcat_psbre2/In0] [get_bd_pins xlconcat_psbre3/In0]
connect_bd_net [get_bd_pins xlslice_10/Dout] [get_bd_pins xlconcat_psbre1/In1]
connect_bd_net [get_bd_pins xlslice_11/Dout] [get_bd_pins xlconcat_psbre2/In1]
connect_bd_net [get_bd_pins xlslice_12/Dout] [get_bd_pins xlconcat_psbre3/In1]
connect_bd_net [get_bd_pins xlslice_13/Dout] [get_bd_pins xlconcat_psbim1/In2]
connect_bd_net [get_bd_pins xlslice_14/Dout] [get_bd_pins xlconcat_psbim2/In2]
connect_bd_net [get_bd_pins xlslice_15/Dout] [get_bd_pins xlconcat_psbim3/In2]
connect_bd_net [get_bd_pins xlslice_16/Dout] [get_bd_pins xlconcat_psbre0/In2]
connect_bd_net [get_bd_pins xlslice_17/Dout] [get_bd_pins xlconcat_psbre2/In2]
connect_bd_net [get_bd_pins xlslice_18/Dout] [get_bd_pins xlconcat_psbre1/In2]
connect_bd_net [get_bd_pins xlslice_19/Dout] [get_bd_pins xlconcat_psbre3/In2]
connect_bd_net [get_bd_pins xlslice_2/Dout] [get_bd_pins xlconcat_psbim0/In1]
connect_bd_net [get_bd_pins xlslice_5/Dout] [get_bd_pins xlconcat_psbim0/In2]
connect_bd_net [get_bd_pins xlslice_6/Dout] [get_bd_pins xlconcat_psbim1/In1]
connect_bd_net [get_bd_pins xlslice_7/Dout] [get_bd_pins xlconcat_psbim2/In1]
connect_bd_net [get_bd_pins xlslice_8/Dout] [get_bd_pins xlconcat_psbim3/In1]
connect_bd_net [get_bd_pins xlslice_9/Dout] [get_bd_pins xlconcat_psbre0/In1]
connect_bd_net -net xlslice_PSBscaleC_Dout [get_bd_pins scale_const16] [get_bd_pins scaler_16bits_1/scale_const16]

current_bd_instance /chan1/fine_nco
connect_bd_net [get_bd_pins ADC_data_im] \
  [get_bd_pins xlslice_im3/Din] [get_bd_pins xlslice_im2/Din] [get_bd_pins xlslice_im1/Din] [get_bd_pins xlslice_im0/Din]
connect_bd_net [get_bd_pins ADC_data_re] \
  [get_bd_pins xlslice_re3/Din] [get_bd_pins xlslice_re2/Din] [get_bd_pins xlslice_re1/Din] [get_bd_pins xlslice_re0/Din]
connect_bd_net -net clk_wiz_0_clk_out1 [get_bd_pins clk_256M] [get_bd_pins cordic_mix_v2_DAC/clk] [get_bd_pins cordic_mix_v2_ADC/clk]
connect_bd_net -net cordic_mix_v2_2_out_im_0 [get_bd_pins cordic_mix_v2_DAC/out_im_0] [get_bd_pins xlconcat_0/In1]
connect_bd_net -net cordic_mix_v2_2_out_im_1 [get_bd_pins cordic_mix_v2_DAC/out_im_1] [get_bd_pins xlconcat_0/In3]
connect_bd_net -net cordic_mix_v2_2_out_im_2 [get_bd_pins cordic_mix_v2_DAC/out_im_2] [get_bd_pins xlconcat_0/In5]
connect_bd_net -net cordic_mix_v2_2_out_im_3 [get_bd_pins cordic_mix_v2_DAC/out_im_3] [get_bd_pins xlconcat_0/In7]
connect_bd_net -net cordic_mix_v2_2_out_re_0 [get_bd_pins cordic_mix_v2_DAC/out_re_0] [get_bd_pins xlconcat_0/In0]
connect_bd_net -net cordic_mix_v2_2_out_re_1 [get_bd_pins cordic_mix_v2_DAC/out_re_1] [get_bd_pins xlconcat_0/In2]
connect_bd_net -net cordic_mix_v2_2_out_re_2 [get_bd_pins cordic_mix_v2_DAC/out_re_2] [get_bd_pins xlconcat_0/In4]
connect_bd_net -net cordic_mix_v2_2_out_re_3 [get_bd_pins cordic_mix_v2_DAC/out_re_3] [get_bd_pins xlconcat_0/In6]
connect_bd_net [get_bd_pins cordic_mix_v2_ADC/out_im_0] [get_bd_pins out_im_0]
connect_bd_net [get_bd_pins cordic_mix_v2_ADC/out_im_1] [get_bd_pins out_im_1]
connect_bd_net [get_bd_pins cordic_mix_v2_ADC/out_im_2] [get_bd_pins out_im_2]
connect_bd_net [get_bd_pins cordic_mix_v2_ADC/out_im_3] [get_bd_pins out_im_3]
connect_bd_net [get_bd_pins cordic_mix_v2_ADC/out_re_0] [get_bd_pins out_re_0]
connect_bd_net [get_bd_pins cordic_mix_v2_ADC/out_re_1] [get_bd_pins out_re_1]
connect_bd_net [get_bd_pins cordic_mix_v2_ADC/out_re_2] [get_bd_pins out_re_2]
connect_bd_net [get_bd_pins cordic_mix_v2_ADC/out_re_3] [get_bd_pins out_re_3]
connect_bd_net -net scaler_16bits_1_psb_dac_im0 [get_bd_pins DAC_im_0] [get_bd_pins cordic_mix_v2_DAC/im_0]
connect_bd_net -net scaler_16bits_1_psb_dac_im1 [get_bd_pins DAC_im_1] [get_bd_pins cordic_mix_v2_DAC/im_1]
connect_bd_net -net scaler_16bits_1_psb_dac_im2 [get_bd_pins DAC_im_2] [get_bd_pins cordic_mix_v2_DAC/im_2]
connect_bd_net -net scaler_16bits_1_psb_dac_im3 [get_bd_pins DAC_im_3] [get_bd_pins cordic_mix_v2_DAC/im_3]
connect_bd_net -net scaler_16bits_1_psb_dac_re0 [get_bd_pins DAC_re_0] [get_bd_pins cordic_mix_v2_DAC/re_0]
connect_bd_net -net scaler_16bits_1_psb_dac_re1 [get_bd_pins DAC_re_1] [get_bd_pins cordic_mix_v2_DAC/re_1]
connect_bd_net -net scaler_16bits_1_psb_dac_re2 [get_bd_pins DAC_re_2] [get_bd_pins cordic_mix_v2_DAC/re_2]
connect_bd_net -net scaler_16bits_1_psb_dac_re3 [get_bd_pins DAC_re_3] [get_bd_pins cordic_mix_v2_DAC/re_3]
connect_bd_net [get_bd_pins xlconcat_0/dout] [get_bd_pins to_DAC]
connect_bd_net -net xlconstant_7_dout [get_bd_pins sync_in] [get_bd_pins cordic_mix_v2_DAC/sync_in] [get_bd_pins cordic_mix_v2_ADC/sync_in]
connect_bd_net -net xlslice_dacmix_dp_Dout [get_bd_pins dphi] [get_bd_pins cordic_mix_v2_DAC/dphi] [get_bd_pins cordic_mix_v2_ADC/dphi]
connect_bd_net [get_bd_pins xlslice_im0/Dout] [get_bd_pins cordic_mix_v2_ADC/re_0]
connect_bd_net [get_bd_pins xlslice_im1/Dout] [get_bd_pins cordic_mix_v2_ADC/re_1]
connect_bd_net [get_bd_pins xlslice_im2/Dout] [get_bd_pins cordic_mix_v2_ADC/re_2]
connect_bd_net [get_bd_pins xlslice_im3/Dout] [get_bd_pins cordic_mix_v2_ADC/re_3]
connect_bd_net [get_bd_pins xlslice_re0/Dout] [get_bd_pins cordic_mix_v2_ADC/im_0]
connect_bd_net [get_bd_pins xlslice_re1/Dout] [get_bd_pins cordic_mix_v2_ADC/im_1]
connect_bd_net [get_bd_pins xlslice_re2/Dout] [get_bd_pins cordic_mix_v2_ADC/im_2]
connect_bd_net [get_bd_pins xlslice_re3/Dout] [get_bd_pins cordic_mix_v2_ADC/im_3]

current_bd_instance /chan2
connect_bd_intf_net [get_bd_intf_pins S_AXI_bram_ctrl_0] [get_bd_intf_pins snap_data_capture/S_AXI_bram_ctrl_0]
connect_bd_intf_net [get_bd_intf_pins S_AXI_bram_ctrl_1] [get_bd_intf_pins snap_data_capture/S_AXI_bram_ctrl_1]
connect_bd_intf_net [get_bd_intf_pins S_AXI_gpio_0] [get_bd_intf_pins GPIO/S_AXI_gpio_0]
connect_bd_intf_net [get_bd_intf_pins S_AXI_gpio_1] [get_bd_intf_pins GPIO/S_AXI_gpio_1]
connect_bd_intf_net [get_bd_intf_pins S_AXI_gpio_2] [get_bd_intf_pins GPIO/S_AXI_gpio_2]
connect_bd_intf_net [get_bd_intf_pins S_AXI_gpio_3] [get_bd_intf_pins GPIO/S_AXI_gpio_3]
connect_bd_intf_net [get_bd_intf_pins S_AXI_gpio_4] [get_bd_intf_pins GPIO/S_AXI_gpio_4]
connect_bd_intf_net [get_bd_intf_pins S_AXI_gpio_5] [get_bd_intf_pins GPIO/S_AXI_gpio_5]
connect_bd_intf_net [get_bd_intf_pins S_AXI_gpio_6] [get_bd_intf_pins GPIO/S_AXI_gpio_6]
connect_bd_intf_net [get_bd_intf_pins S_AXI_gpio_7] [get_bd_intf_pins GPIO/S_AXI_gpio_7]
connect_bd_intf_net [get_bd_intf_pins S_AXI_gpio_8] [get_bd_intf_pins GPIO/S_AXI_gpio_8]
connect_bd_intf_net [get_bd_intf_pins S_AXI_gpio_9] [get_bd_intf_pins GPIO/S_AXI_gpio_9]
connect_bd_intf_net [get_bd_intf_pins S_AXI_gpio_10] [get_bd_intf_pins GPIO/S_AXI_gpio_10]
connect_bd_net [get_bd_pins ADC_data_im] [get_bd_pins fine_nco/ADC_data_im] [get_bd_pins snap_data_capture/ADC_data_im]
connect_bd_net [get_bd_pins ADC_data_re] [get_bd_pins fine_nco/ADC_data_re] [get_bd_pins snap_data_capture/ADC_data_re]
connect_bd_net -net clk_wiz_0_clk_out1 [get_bd_pins CLK] \
  [get_bd_pins c_shift_ram_4/CLK] [get_bd_pins psb3_0_0/clk] [get_bd_pins psb_out_post/clk] [get_bd_pins fine_nco/clk_256M] \
  [get_bd_pins snap_data_capture/clk_256M] [get_bd_pins receive1_3_0/clk]
connect_bd_net [get_bd_pins const_zero31/dout] [get_bd_pins xlconcat_6/In3]
connect_bd_net -net cordic_mix_v2_ADC_out_im_0 [get_bd_pins fine_nco/out_im_0] [get_bd_pins receive1_3_0/in_re_0]
connect_bd_net -net cordic_mix_v2_ADC_out_im_1 [get_bd_pins fine_nco/out_im_1] [get_bd_pins receive1_3_0/in_re_1]
connect_bd_net -net cordic_mix_v2_ADC_out_im_2 [get_bd_pins fine_nco/out_im_2] [get_bd_pins receive1_3_0/in_re_2]
connect_bd_net -net cordic_mix_v2_ADC_out_im_3 [get_bd_pins fine_nco/out_im_3] [get_bd_pins receive1_3_0/in_re_3]
connect_bd_net -net cordic_mix_v2_ADC_out_re_0 [get_bd_pins fine_nco/out_re_0] [get_bd_pins receive1_3_0/in_im_0]
connect_bd_net -net cordic_mix_v2_ADC_out_re_1 [get_bd_pins fine_nco/out_re_1] [get_bd_pins receive1_3_0/in_im_1]
connect_bd_net -net cordic_mix_v2_ADC_out_re_2 [get_bd_pins fine_nco/out_re_2] [get_bd_pins receive1_3_0/in_im_2]
connect_bd_net -net cordic_mix_v2_ADC_out_re_3 [get_bd_pins fine_nco/out_re_3] [get_bd_pins receive1_3_0/in_im_3]
connect_bd_net -net proc_sys_reset_0_peripheral_aresetn [get_bd_pins s_axi_aresetn256] [get_bd_pins snap_data_capture/s_axi_aresetn256]
connect_bd_net -net psb2_0_0_gout_psb_tvalid [get_bd_pins c_shift_ram_4/Q] [get_bd_pins receive1_3_0/in_tvalid]
connect_bd_net [get_bd_pins psb3_0_0/gout_ov_add] [get_bd_pins xlconcat_6/In2]
connect_bd_net [get_bd_pins psb3_0_0/gout_ov_ifft] [get_bd_pins xlconcat_6/In1]
connect_bd_net [get_bd_pins psb3_0_0/gout_psb_tvalid] [get_bd_pins c_shift_ram_4/D]
connect_bd_net -net psb_im0_1 [get_bd_pins psb3_0_0/gout_psb_im_0] [get_bd_pins psb_out_post/psb_im0]
connect_bd_net -net psb_im1_1 [get_bd_pins psb3_0_0/gout_psb_im_1] [get_bd_pins psb_out_post/psb_im1]
connect_bd_net -net psb_im2_1 [get_bd_pins psb3_0_0/gout_psb_im_2] [get_bd_pins psb_out_post/psb_im2]
connect_bd_net -net psb_im3_1 [get_bd_pins psb3_0_0/gout_psb_im_3] [get_bd_pins psb_out_post/psb_im3]
connect_bd_net -net psb_re0_1 [get_bd_pins psb3_0_0/gout_psb_re_0] [get_bd_pins psb_out_post/psb_re0]
connect_bd_net -net psb_re1_1 [get_bd_pins psb3_0_0/gout_psb_re_1] [get_bd_pins psb_out_post/psb_re1]
connect_bd_net -net psb_re2_1 [get_bd_pins psb3_0_0/gout_psb_re_2] [get_bd_pins psb_out_post/psb_re2]
connect_bd_net -net psb_re3_1 [get_bd_pins psb3_0_0/gout_psb_re_3] [get_bd_pins psb_out_post/psb_re3]
connect_bd_net [get_bd_pins receive1_3_0/acc_tvalid] [get_bd_pins snap_data_capture/tvalid]
connect_bd_net [get_bd_pins receive1_3_0/acc_tvalid_eth] [get_bd_pins acc_tvalid_eth]
connect_bd_net [get_bd_pins receive1_3_0/snap_i0] [get_bd_pins xlconcat_1/In0]
connect_bd_net [get_bd_pins receive1_3_0/snap_i1] [get_bd_pins xlconcat_1/In2]
connect_bd_net [get_bd_pins receive1_3_0/snap_i2] [get_bd_pins xlconcat_1/In4]
connect_bd_net [get_bd_pins receive1_3_0/snap_i3] [get_bd_pins xlconcat_1/In6]
connect_bd_net [get_bd_pins receive1_3_0/snap_q0] [get_bd_pins xlconcat_1/In1]
connect_bd_net [get_bd_pins receive1_3_0/snap_q1] [get_bd_pins xlconcat_1/In3]
connect_bd_net [get_bd_pins receive1_3_0/snap_q2] [get_bd_pins xlconcat_1/In5]
connect_bd_net [get_bd_pins receive1_3_0/snap_q3] [get_bd_pins xlconcat_1/In7]
connect_bd_net -net reset_Dout [get_bd_pins GPIO/psb_rst] [get_bd_pins psb3_0_0/gin_tl_reset]
connect_bd_net -net rst_ps8_0_99M_peripheral_aresetn [get_bd_pins s_axi_aresetn99] [get_bd_pins GPIO/s_axi_aresetn]
connect_bd_net -net scale_const16_1 [get_bd_pins GPIO/psb_postScale] [get_bd_pins psb_out_post/scale_const16]
connect_bd_net -net scaler_16bits_1_ov [get_bd_pins psb_out_post/ov] [get_bd_pins xlconcat_6/In0]
connect_bd_net -net scaler_16bits_1_psb_dac_im0 [get_bd_pins psb_out_post/psb_dac_im0] [get_bd_pins fine_nco/DAC_im_0]
connect_bd_net -net scaler_16bits_1_psb_dac_im1 [get_bd_pins psb_out_post/psb_dac_im1] [get_bd_pins fine_nco/DAC_im_1]
connect_bd_net -net scaler_16bits_1_psb_dac_im2 [get_bd_pins psb_out_post/psb_dac_im2] [get_bd_pins fine_nco/DAC_im_2]
connect_bd_net -net scaler_16bits_1_psb_dac_im3 [get_bd_pins psb_out_post/psb_dac_im3] [get_bd_pins fine_nco/DAC_im_3]
connect_bd_net -net scaler_16bits_1_psb_dac_re0 [get_bd_pins psb_out_post/psb_dac_re0] [get_bd_pins fine_nco/DAC_re_0]
connect_bd_net -net scaler_16bits_1_psb_dac_re1 [get_bd_pins psb_out_post/psb_dac_re1] [get_bd_pins fine_nco/DAC_re_1]
connect_bd_net -net scaler_16bits_1_psb_dac_re2 [get_bd_pins psb_out_post/psb_dac_re2] [get_bd_pins fine_nco/DAC_re_2]
connect_bd_net -net scaler_16bits_1_psb_dac_re3 [get_bd_pins psb_out_post/psb_dac_re3] [get_bd_pins fine_nco/DAC_re_3]
connect_bd_net -net start_chan2_1 [get_bd_pins start_chan2] [get_bd_pins psb3_0_0/gin_tl_start]
connect_bd_net -net we_even_1_Dout [get_bd_pins GPIO/psb_tone_we_even1] [get_bd_pins psb3_0_0/gin_we_even_1]
connect_bd_net -net we_even_2_Dout [get_bd_pins GPIO/psb_tone_we_even2] [get_bd_pins psb3_0_0/gin_we_even_2]
connect_bd_net -net we_even_3_Dout [get_bd_pins GPIO/psb_tone_we_even3] [get_bd_pins psb3_0_0/gin_we_even_3]
connect_bd_net -net we_even_4_Dout [get_bd_pins GPIO/psb_tone_we_even4] [get_bd_pins psb3_0_0/gin_we_even_4]
connect_bd_net -net we_odd_10_Dout [get_bd_pins GPIO/psb_toneSelect_w_D3] [get_bd_pins psb3_0_0/ts_3]
connect_bd_net -net we_odd_11_Dout [get_bd_pins GPIO/psb_toneSelect_w_D4] [get_bd_pins psb3_0_0/ts_4]
connect_bd_net -net we_odd_12_Dout [get_bd_pins GPIO/psb_toneSelect_w_D5] [get_bd_pins psb3_0_0/ts_5]
connect_bd_net -net we_odd_13_Dout [get_bd_pins GPIO/psb_toneSelect_w_D6] [get_bd_pins psb3_0_0/ts_6]
connect_bd_net -net we_odd_14_Dout [get_bd_pins GPIO/psb_toneSelect_w_D7] [get_bd_pins psb3_0_0/ts_7]
connect_bd_net -net we_odd_1_Dout [get_bd_pins GPIO/psb_tone_we_odd1] [get_bd_pins psb3_0_0/gin_we_odd_1]
connect_bd_net -net we_odd_2_Dout [get_bd_pins GPIO/psb_tone_we_odd2] [get_bd_pins psb3_0_0/gin_we_odd_2]
connect_bd_net -net we_odd_3_Dout [get_bd_pins GPIO/psb_tone_we_odd3] [get_bd_pins psb3_0_0/gin_we_odd_3]
connect_bd_net -net we_odd_4_Dout [get_bd_pins GPIO/psb_tone_we_odd4] [get_bd_pins psb3_0_0/gin_we_odd_4]
connect_bd_net -net we_odd_5_Dout [get_bd_pins GPIO/psb_toneSelect_we] [get_bd_pins psb3_0_0/ts_w]
connect_bd_net -net we_odd_6_Dout [get_bd_pins GPIO/psb_toneSelect_w_addr] [get_bd_pins psb3_0_0/ts_a]
connect_bd_net -net we_odd_7_Dout [get_bd_pins GPIO/psb_toneSelect_w_D0] [get_bd_pins psb3_0_0/ts_0]
connect_bd_net -net we_odd_8_Dout [get_bd_pins GPIO/psb_toneSelect_w_D1] [get_bd_pins psb3_0_0/ts_1]
connect_bd_net -net we_odd_9_Dout [get_bd_pins GPIO/psb_toneSelect_w_D2] [get_bd_pins psb3_0_0/ts_2]
connect_bd_net -net xlconcat_0_dout [get_bd_pins fine_nco/to_DAC] [get_bd_pins to_DAC] [get_bd_pins snap_data_capture/DAC_data]
connect_bd_net [get_bd_pins xlconcat_1/dout] [get_bd_pins timestream_out] [get_bd_pins snap_data_capture/rec_output]
connect_bd_net [get_bd_pins xlconcat_6/dout] [get_bd_pins GPIO/dsp_ov_flag]
connect_bd_net [get_bd_pins xlconstant_7/dout] [get_bd_pins fine_nco/sync_in]
connect_bd_net -net xlslice_0_Dout [get_bd_pins GPIO/psb_tone_w_init_re] [get_bd_pins psb3_0_0/gin_init_re]
connect_bd_net -net xlslice_1_Dout [get_bd_pins GPIO/psb_tone_w_init_im] [get_bd_pins psb3_0_0/gin_init_im]
connect_bd_net -net xlslice_3_Dout [get_bd_pins GPIO/psb_tone_w_addr] [get_bd_pins psb3_0_0/gin_addr]
connect_bd_net -net xlslice_4_Dout [get_bd_pins GPIO/psb_tone_w_dphi] [get_bd_pins psb3_0_0/gin_dphi]
connect_bd_net -net xlslice_5_Dout [get_bd_pins GPIO/rec_acc_length] [get_bd_pins receive1_3_0/acc_length]
connect_bd_net -net xlslice_beat_addr_Dout [get_bd_pins GPIO/rec_beatDphi_w_addr] [get_bd_pins receive1_3_0/w_beat_addr]
connect_bd_net -net xlslice_beat_dphi_Dout [get_bd_pins GPIO/rec_beatDphi_w_D] [get_bd_pins receive1_3_0/w_beat_dphi]
connect_bd_net -net xlslice_beat_we0_Dout [get_bd_pins GPIO/rec_beatDphi_we0] [get_bd_pins receive1_3_0/beat_we0]
connect_bd_net -net xlslice_beat_we1_Dout [get_bd_pins GPIO/rec_beatDphi_we1] [get_bd_pins receive1_3_0/beat_we1]
connect_bd_net -net xlslice_beat_we2_Dout [get_bd_pins GPIO/rec_beatDphi_we2] [get_bd_pins receive1_3_0/beat_we2]
connect_bd_net -net xlslice_beat_we3_Dout [get_bd_pins GPIO/rec_beatDphi_we3] [get_bd_pins receive1_3_0/beat_we3]
connect_bd_net -net xlslice_bin_sel_addr_Dout [get_bd_pins GPIO/rec_binSelect_w_addr] [get_bd_pins receive1_3_0/w_binsel_addr]
connect_bd_net -net xlslice_bin_sel_data1_Dout [get_bd_pins GPIO/rec_binSelect_w_D1] [get_bd_pins receive1_3_0/w_binsel_data1]
connect_bd_net -net xlslice_bin_sel_data_Dout [get_bd_pins GPIO/rec_binSelect_w_D0] [get_bd_pins receive1_3_0/w_binsel_data0]
connect_bd_net -net xlslice_bin_sel_we_Dout [get_bd_pins GPIO/rec_binSelect_we] [get_bd_pins receive1_3_0/binsel_we]
connect_bd_net -net xlslice_bram_rst_Dout [get_bd_pins GPIO/getAccumCtrl_rst] [get_bd_pins snap_data_capture/getAccumCtrl_rst]
connect_bd_net -net xlslice_bramx32v2_start_Dout [get_bd_pins GPIO/axibramx32v2_start] [get_bd_pins snap_data_capture/axibramx32v2_start]
connect_bd_net -net xlslice_dacmix_dp_Dout [get_bd_pins GPIO/fineNCO_dphi] [get_bd_pins fine_nco/dphi]
connect_bd_net -net xlslice_fft_scale_Dout [get_bd_pins GPIO/rec_fft_scale] [get_bd_pins receive1_3_0/fft_scale]
connect_bd_net -net xlslice_getAccumChan_Dout [get_bd_pins GPIO/getAccum_channel_count] [get_bd_pins snap_data_capture/max_chan_minus_three]
connect_bd_net -net zynq_ultra_ps_e_0_pl_clk0 [get_bd_pins s_axi_aclk99] [get_bd_pins GPIO/s_axi_aclk]
